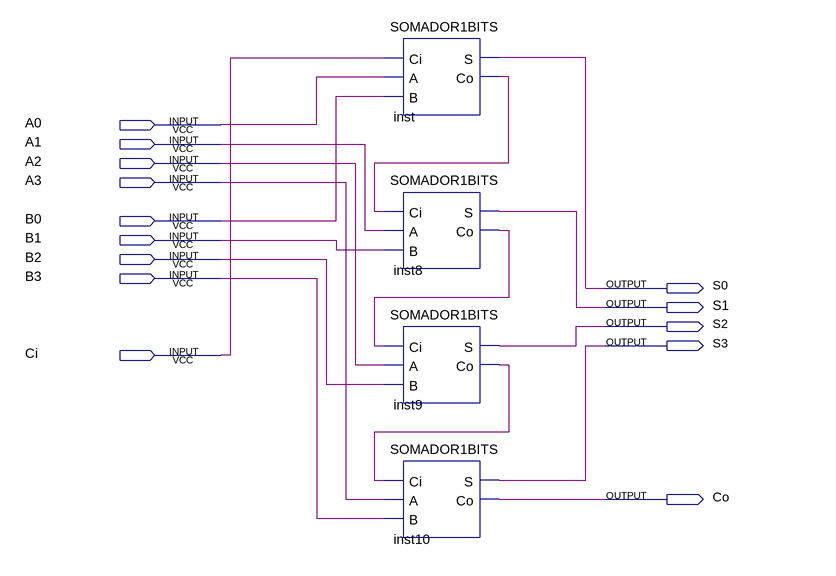
[diagram p0: schematic sheet]
// Quartus schematic SOMADOR4BITS.bdf as structural Verilog: 4 symbols, 14 pins
module SOMADOR4BITS (
  input  A0,
  input  A1,
  input  A2,
  input  A3,
  input  B0,
  input  B1,
  input  B2,
  input  B3,
  input  Ci,
  output S0,
  output S1,
  output S2,
  output S3,
  output Co
);

  wire inst8_co, inst9_co, inst_co;

  SOMADOR1BITS inst (.Ci(Ci), .A(A0), .B(B0), .S(S0), .Co(inst_co));
  SOMADOR1BITS inst8 (.Ci(inst_co), .A(A1), .B(B1), .S(S1), .Co(inst8_co));
  SOMADOR1BITS inst9 (.Ci(inst8_co), .A(A2), .B(B2), .S(S2), .Co(inst9_co));
  SOMADOR1BITS inst10 (.Ci(inst9_co), .A(A3), .B(B3), .S(S3), .Co(Co));
endmodule
